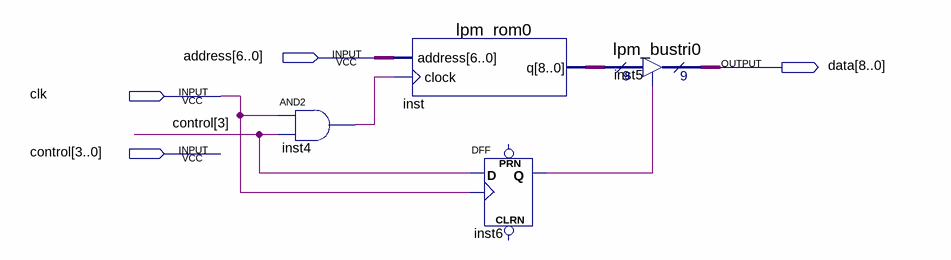
[diagram p0: schematic sheet]
// Quartus schematic ROM.bdf as structural Verilog: 4 symbols, 4 pins
module ROM (
  input  [6:0] address,
  input  clk,
  input  [3:0] control,
  output [8:0] data
);

  wire inst4_out, inst6_q;
  wire [8:0] inst_q;

  and inst4 (inst4_out, clk, control[3]);
  lpm_rom0 inst (.address(address), .clock(inst4_out), .q(inst_q));
  DFF inst6 (.CLK(clk), .D(control[3]), .Q(inst6_q));  // open: CLRN, PRN
  lpm_bustri0 inst5 (.enabledt(inst6_q), .data(inst_q), .tridata(data));
endmodule
